# Altium schematic sheet lpc_ws.SchDoc
size A4
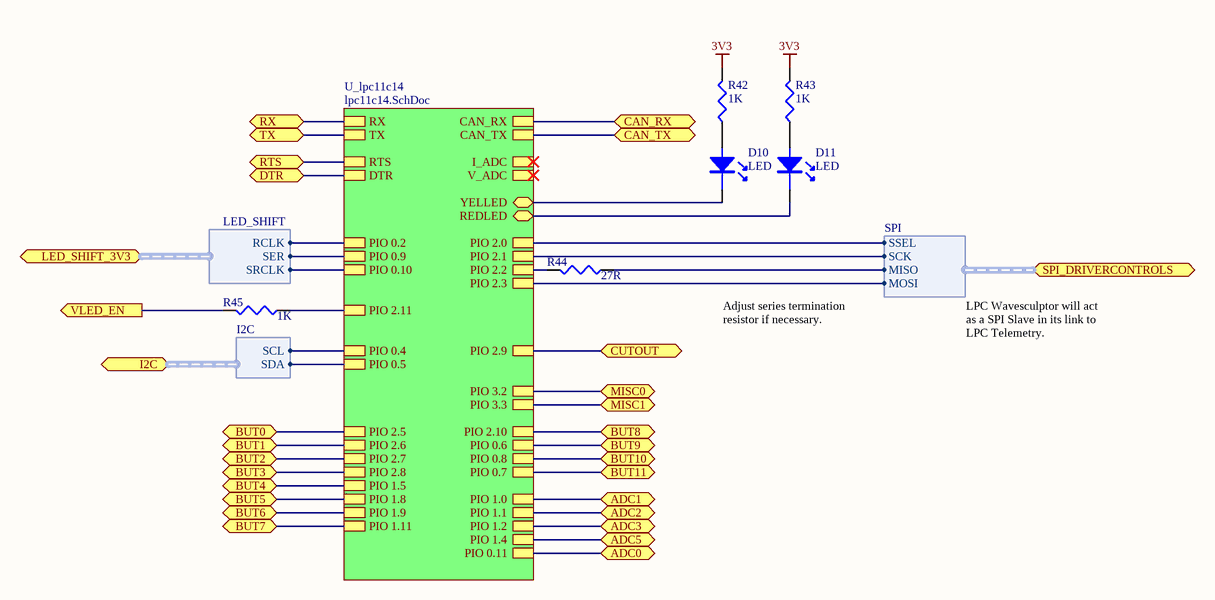
[diagram p0: lpc_ws.SchDoc]

## Parts
D10  LED  [0805LED]
D11  LED  [0805LED]
R42  1K  [0603]
R43  1K  [0603]
R44  27R  [0603]
R45  1K  [0603]

## Sub-sheets
U_lpc11c14 = lpc11c14.SchDoc: TX, RX, CAN_RX, CAN_TX, RTS, DTR, YELLED (bidir), REDLED (bidir), I_ADC, V_ADC, PIO 2.1, PIO 2.5, PIO 2.9, PIO 2.10, PIO 2.2, PIO 0.8, PIO 0.9, PIO 0.10, PIO 2.11, PIO 0.11, PIO 1.0, PIO 1.1, PIO 1.2, PIO 2.3, PIO 1.4, PIO 3.2, PIO 1.5, PIO 3.3, PIO 0.2, PIO 0.4, PIO 0.5, PIO 0.6, PIO 0.7, PIO 2.6, PIO 2.0, PIO 2.7, PIO 2.8, PIO 1.8, PIO 1.9, PIO 1.11

## Ports
ADC0, ADC1, ADC2, ADC3, ADC5, BUT0, BUT1, BUT2, BUT3, BUT4, BUT5, BUT6, BUT7, BUT8, BUT9, BUT10, BUT11, CAN_RX, CAN_TX, CUTOUT, DTR, I2C (harness I2C), LED_SHIFT_3V3 (harness LED_SHIFT), MISC0, MISC1, RTS, RX, SPI_DRIVERCONTROLS (harness SPI), TX, VLED_EN (out)

## Harnesses
SPI: SSEL, SCK, MOSI, MISO
LED_SHIFT: RCLK, SER, SRCLK
I2C: SCL, SDA

## Nets
3V3: R42.2 R43.2
ADC0: port ADC0, sheet U_lpc11c14/PIO 0.11
ADC1: port ADC1, sheet U_lpc11c14/PIO 1.0
ADC2: port ADC2, sheet U_lpc11c14/PIO 1.1
ADC3: port ADC3, sheet U_lpc11c14/PIO 1.2
ADC5: port ADC5, sheet U_lpc11c14/PIO 1.4
BUT0: port BUT0, sheet U_lpc11c14/PIO 2.5
BUT1: port BUT1, sheet U_lpc11c14/PIO 2.6
BUT2: port BUT2, sheet U_lpc11c14/PIO 2.7
BUT3: port BUT3, sheet U_lpc11c14/PIO 2.8
BUT4: port BUT4, sheet U_lpc11c14/PIO 1.5
BUT5: port BUT5, sheet U_lpc11c14/PIO 1.8
BUT6: port BUT6, sheet U_lpc11c14/PIO 1.9
BUT7: port BUT7, sheet U_lpc11c14/PIO 1.11
BUT8: port BUT8, sheet U_lpc11c14/PIO 2.10
BUT9: port BUT9, sheet U_lpc11c14/PIO 0.6
BUT10: port BUT10, sheet U_lpc11c14/PIO 0.8
BUT11: port BUT11, sheet U_lpc11c14/PIO 0.7
CAN_RX: port CAN_RX, sheet U_lpc11c14/CAN_RX
CAN_TX: port CAN_TX, sheet U_lpc11c14/CAN_TX
CUTOUT: port CUTOUT, sheet U_lpc11c14/PIO 2.9
DTR: port DTR, sheet U_lpc11c14/DTR
MISC0: port MISC0, sheet U_lpc11c14/PIO 3.2
MISC1: port MISC1, sheet U_lpc11c14/PIO 3.3
RTS: port RTS, sheet U_lpc11c14/RTS
RX: port RX, sheet U_lpc11c14/RX
TX: port TX, sheet U_lpc11c14/TX
VLED_EN: R45.2 ; port VLED_EN
NetD10_A: D10.A R42.1
NetD10_K: D10.K ; sheet U_lpc11c14/YELLED
NetD11_A: D11.A R43.1
NetD11_K: D11.K ; sheet U_lpc11c14/REDLED
NetR44_1: R44.1 ; port SPI_DRIVERCONTROLS.MISO
NetR44_2: R44.2 ; sheet U_lpc11c14/PIO 2.2
NetR45_1: R45.1 ; sheet U_lpc11c14/PIO 2.11
(unnamed): sheet U_lpc11c14/PIO 2.1, port SPI_DRIVERCONTROLS.SCK
(unnamed): sheet U_lpc11c14/PIO 0.9, port LED_SHIFT_3V3.SER
(unnamed): sheet U_lpc11c14/PIO 0.10, port LED_SHIFT_3V3.SRCLK
(unnamed): sheet U_lpc11c14/PIO 2.3, port SPI_DRIVERCONTROLS.MOSI
(unnamed): sheet U_lpc11c14/PIO 0.2, port LED_SHIFT_3V3.RCLK
(unnamed): sheet U_lpc11c14/PIO 0.4, port I2C.SCL
(unnamed): sheet U_lpc11c14/PIO 0.5, port I2C.SDA
(unnamed): sheet U_lpc11c14/PIO 2.0, port SPI_DRIVERCONTROLS.SSEL

## Notes on the sheet
- Adjust series termination resistor if necessary.
- LPC Wavesculptor will act as a SPI Slave in its link to LPC Telemetry.

## Library data of the parts
D10 = LED: Manufacturer: OSRAM Opto Semiconductors Inc; Manufacturer Part Number: LY R976-PS-36; Description: LED CHIPLED 588NM YLW 0805 SMD; Color: Yellow; Millicandela Rating: 162.5mcd; Voltage - Forward (Vf) Typ: 2V; Current - Test: 20mA; Wavelength - Dominant: 588nm; Wavelength - Peak: 591nm; Viewing Angle: 160°; Lens Type: Diffused; Lens Style/Size: Rectangle with Flat Top, 1.3mm x 1.25mm; Luminous Flux @ Current - Test: 520 mlm; Supplier 1: Digi-Key; Supplier Part Number 1: 475-2560-1-ND; RoHS: RoHS Compliant; Category: Optoelectronics; Stock 1: 42136; Pricing 1: 1=0.14, 10=0.112, 100=0.0892, 250=0.07804, 500=0.07132 (AUD); Packaging: Cut Tape (CT); Package / Case: 0805 (2012 Metric); Size / Dimension: 2.00mm L x 1.25mm W; Height: 0.80mm; Mounting Type: Surface Mount; ComponentLink1URL: http://catalog.osram-os.com/jsp/download.jsp?name=LO_LS_LY_R976.pdf&url=/media/_en/Graphics/00042116_0.pdf; ComponentLink1Description: http://catalog.osram-os.com/jsp/download.jsp?name=LO_LS_LY_R976.pdf&url=/media/_en/Graphics/00042116_0.pdf
D11 = LED: Manufacturer: OSRAM Opto Semiconductors Inc; Manufacturer Part Number: LS R976-NR-1; Description: LED CHIPLED 633NM RED 0805 SMD; Color: Red; Millicandela Rating: 104mcd; Voltage - Forward (Vf) Typ: 2V; Current - Test: 20mA; Wavelength - Dominant: 633nm; Wavelength - Peak: 645nm; Viewing Angle: 160°; Lens Type: Diffused; Lens Style/Size: Rectangle with Flat Top, 1.3mm x 1.25mm; Luminous Flux @ Current - Test: 330 mlm; Supplier 1: Digi-Key; Supplier Part Number 1: 475-1278-1-ND; RoHS: RoHS Compliant; Category: Optoelectronics; Stock 1: 53912; Pricing 1: 1=0.14, 10=0.112, 100=0.0892, 250=0.07804, 500=0.07132 (AUD); Packaging: Cut Tape (CT); Package / Case: 0805 (2012 Metric); Size / Dimension: 2.00mm L x 1.25mm W; Height: 0.80mm; Mounting Type: Surface Mount; ComponentLink1URL: http://catalog.osram-os.com/jsp/download.jsp?name=LO_LS_LY_R976.pdf&url=/media/_en/Graphics/00042116_0.pdf; ComponentLink1Description: http://catalog.osram-os.com/jsp/download.jsp?name=LO_LS_LY_R976.pdf&url=/media/_en/Graphics/00042116_0.pdf
R42 R43 = RES1: Resistor
R44 = RES1: Resistor; Manufacturer: Panasonic Electronic Components; Manufacturer Part Number: ERJ-3EKF27R0V; Description: RES 27 OHM 1/10W 1% 0603 SMD; Resistance (Ohms): 27; Power (Watts): 0.1W, 1/10W; Temperature Coefficient: ±100ppm/°C; Tolerance: ±1%; Supplier 1: Digi-Key; Supplier Part Number 1: P27.0HCT-ND; RoHS: RoHS Compliant; Category: Resistors; Stock 1: 89523; Pricing 1: 1=0.12, 50=0.0166, 100=0.0126, 250=0.00936, 500=0.00692, 1000=0.00461 (AUD); Packaging: Cut Tape (CT); Composition: Thick Film; Features: -; Package / Case: 0603 (1608 Metric); Supplier Device Package: 0603; Size / Dimension: 0.063" L x 0.031" W (1.60mm x 0.80mm); Height: 0.022" (0.55mm); Number of Terminations: 2; ComponentLink1URL: http://industrial.panasonic.com/www-cgi/jvcr13pz.cgi?E+PZ+3+AOA0002+ERJ3EKF27R0V+7+WW; ComponentLink1Description: http://industrial.panasonic.com/www-cgi/jvcr13pz.cgi?E+PZ+3+AOA0002+ERJ3EKF27R0V+7+WW
R45 = RES1: Resistor; Value: 20k; Needed?: NO - HW LAB